# EAGLE design uLED_v1 (EAGLE 9.2.0)
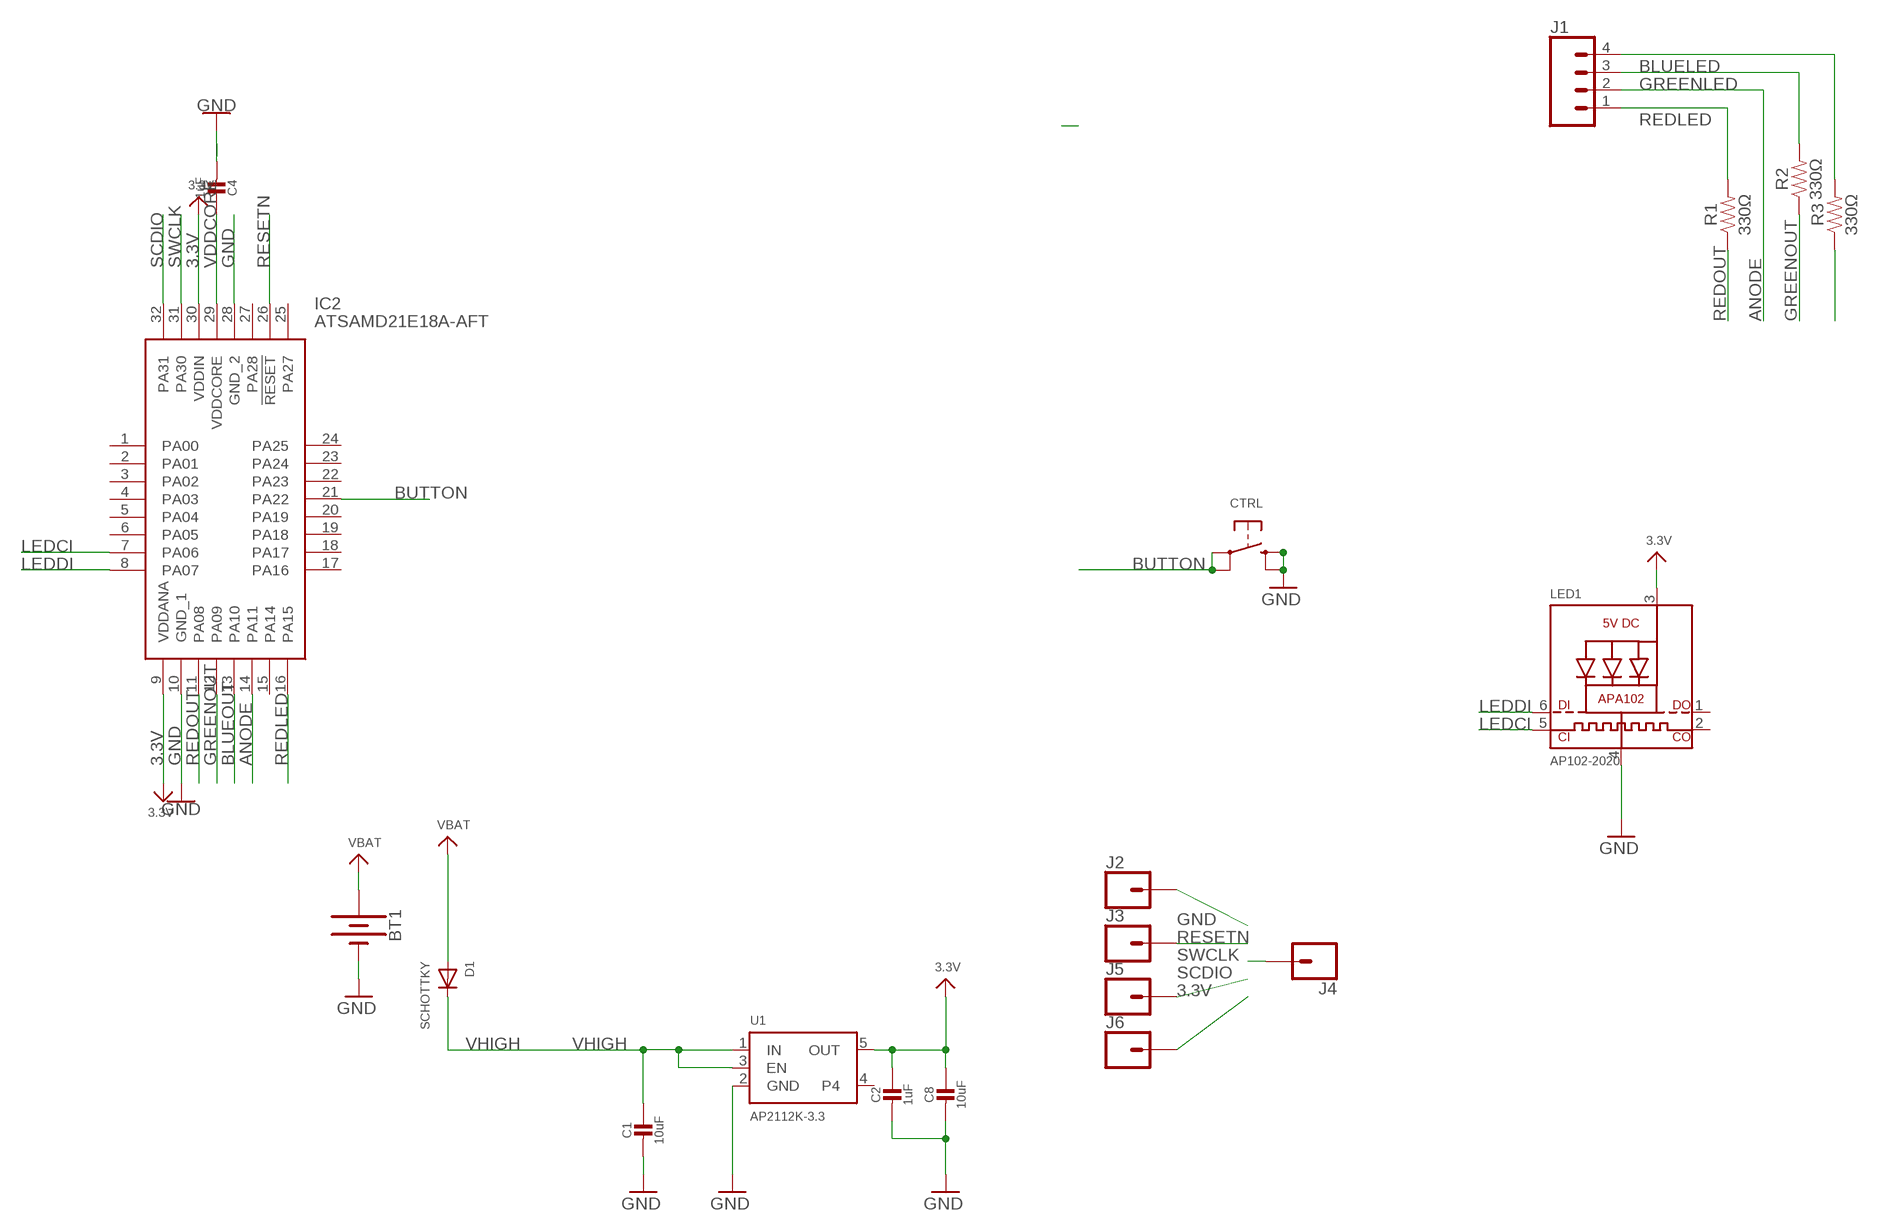
[diagram p0: schematic, sheet 1]

## Parts
BT1  BATTERY-12MM_SMD  [BATTCON_12MM]
C1  10uF  CAP_CERAMIC0805-NOOUTLINE  [0805-NO]
C2  1uF  CAP_CERAMIC0603_NO  [0603-NO]
C4  1uF  CAP_CERAMIC0603_NO  [0603-NO]
C8  10uF  CAP_CERAMIC0805-NOOUTLINE  [0805-NO]
CTRL  SWITCH_TACT_SMT4.6X2.8  [BTN_KMR2_4.6X2.8]
D1  SCHOTTKY  DIODE_SOD-123FL  [SOD-123FL]
IC2  ATSAMD21E18A-AFT  [QFP80P900X900X120-32N]
J1  CONN_04  [1X04]
J2  CONN_01  [1X01]
J3  CONN_01  [1X01]
J4  CONN_01  [1X01]
J5  CONN_01  [1X01]
J6  CONN_01  [1X01]
LED1  AP102-2020  APA1022020  [APA102_2020]
R1  330Ω  0.27OHM-0603-1/10W-1%  [0603]
R2  330Ω  0.27OHM-0603-1/10W-1%  [0603]
R3  330Ω  0.27OHM-0603-1/10W-1%  [0603]
U1  AP2112K-3.3  VREG_SOT23-5  [SOT23-5]

## Nets
3.3V: C2.1 C8.1 IC2.9(VDDANA) IC2.30(VDDIN) J6.1 LED1.3(VDD) U1.5(OUT)
ANODE: IC2.14(PA11) J1.2
BLUELED: J1.4 R3.2
BLUEOUT: IC2.13(PA10) R3.1
BUTTON: CTRL.A'(P1) CTRL.A(P) IC2.21(PA22)
GND: BT1.GND(-) C1.2 C2.2 C4.2 C8.2 CTRL.B'(S1) CTRL.B(S) IC2.10(GND_1) IC2.28(GND_2) J2.1 LED1.4(GND) U1.2(GND)
GREENLED: J1.3 R2.2
GREENOUT: IC2.12(PA09) R2.1
LEDCI: IC2.7(PA06) LED1.5(CKI)
LEDDI: IC2.8(PA07) LED1.6(DI)
REDLED: IC2.16(PA15) J1.1 R1.2
REDOUT: IC2.11(PA08) R1.1
RESETN: IC2.26(!RESET) J3.1
SCDIO: IC2.32(PA31) J5.1
SWCLK: IC2.31(PA30) J4.1
VBAT: BT1.PWR@1(+) D1.A
VDDCORE: C4.1 IC2.29(VDDCORE)
VHIGH: C1.1 D1.C U1.1(IN) U1.3(EN)
Unconnected: IC2.1(PA00) IC2.2(PA01) IC2.3(PA02) IC2.4(PA03) IC2.5(PA04) IC2.6(PA05) IC2.15(PA14) IC2.17(PA16) IC2.18(PA17) IC2.19(PA18) IC2.20(PA19) IC2.22(PA23) IC2.23(PA24) IC2.24(PA25) IC2.25(PA27) IC2.27(PA28) LED1.1(DO) LED1.2(CKO) U1.4

## Library data of the parts
BT1 = SparkFun-Batteries:BATTERY: Battery - Single Cell A variety of battery chemistries, sizes, and footprints. Device List: 20MM_PTH - Coin Cell Battery Holder - 20mm (PTH) <https://www.sparkfun.com/products/783> 20MM_PTH_KIT- Coin Cell battery Holder - 20 mm (PTH) <http://www.sparkfun.com/products/783>kit version with special mask 6.8MM_PTH - Coin Cell Battery Holder - 6.8MM(SMD) <https://www.digikey.com/product-detail/en/seiko-instruments/MS621FE-FL11E/728-1057-ND/1889208?WT.srch=1&gclid=CNOQ5a6LzdQCFZS2wAodXCkE0g> 12MM_SMD - Coin Cell Battery Holder - 12mm (SMD) <https://www.sparkfun.com/products/10592> 12MM_PTH - Coin Cell Battery Holder - 12mm (PTH) <https://www.sparkfun.com/products/7948> 20MM_SMD - 20mm Coin Cell Battery Holder (SMD) (2 legs) Used on the Big Time Watch Kit <https://www.sparkfun.com/products/11734> 20MM_SMD_4LEGS - Coin Cell Battery Holder - 20mm (SMD) <https://www.sparkfun.com/products/11892> 20MM_SMD_4LEGS_OVERPASTE - Coin Cell Battery Holder - 20mm (SMD) <https://www.sparkfun.com/products/11892> (Over-paste on the legs) 24.5MM_PTH - Coin Cell Battery Holder - 24.5mm (PTH) <https://www.sparkfun.com/products/8863> 9V - 9V Battery Holder - PC Mount Used on the SparkFun SparkPunk Sound Kit <https://www.sparkfun.com/products/11177> and SparkFun SparkPunk Sequencer Kit <https://www.sparkfun.com/products/12707> 18650 - Battery Holder - 18650 (PTH) <https://www.sparkfun.com/products/13113> AA - Battery Holder - 1xAA (PTH) <https://www.sparkfun.com/products/7949> AAA - Battery Holder - 1xAAA (PTH) <https://www.sparkfun.com/products/12718> AA_KIT - Battery Holder - 1xAA (PTH) <https://www.sparkfun.com/products/7949> Special kit package - pads only have exposed copper on one side of the board. AAA_KIT - Battery Holder - 1xAAA (PTH) <https://www.sparkfun.com/products/12718> Special kit package - pads only have exposed copper on one side of the board.; PROD_ID: BATT-08044; SF_SKU: PRT-10592
C1 C2 C4 C8 = microbuilder:CAP_CERAMIC: Ceramic Capacitors For new designs, use the packages preceded by an '_' character since they are more reliable: The following footprints should be used on most boards: _0402 - Standard footprint for regular board layouts _0603 - Standard footprint for regular board layouts _0805 - Standard footprint for regular board layouts _1206 - Standard footprint for regular board layouts For extremely tight-pitch boards where space is at a premium, the following 'micro-pitch' footprints can be used (smaller pads, no silkscreen outline, etc.): _0402MP - Micro-pitch footprint for very dense/compact boards _0603MP - Micro-pitch footprint for very dense/compact boards _0805MP - Micro-pitch footprint for very dense/compact boards _1206MP - Micro-pitch footprint for very dense/compact boards
CTRL = microbuilder:SWITCH_TACT_SMT: SMT Tact Switches 6x6mm - Digikey: P12940SCT-ND KMR2 (4.6x2.8mm) - Digikey: 401-1426-1-ND EVQ-PQHB55 - Light Touch, 160GF (4.5x4.5mm) - Digikey: P8090SCT-ND KMT0 - KMT021 NGJ LHS (etc.) IP68/Waterproof - Digikey: CKN10289CT-ND
D1 = adafruit:DIODE: Diode SMADIODE - SMA Surface Mount Package 20V 1A Schottky Diode Digikey: 641-1014-6-ND DO-1N4148 - Through Hole Small Current Diode SOD-123 20V 1 A (.5mV Vf) Schottky Diode - Digikey: MBRX120TPMSCT-ND SOD-323 10V 570mA (.38mV Vf, 3ns) Schottky Diode - Digikey: ZLLS410CT-ND SOD-523 30V 30mA Schottky Diode (RB751S-40TE61) - Digikey: RB751S-40TE61CT-ND SOT23-R/W - SOT23 Package (R = Solder Paste/Reflow Ovens, W = Hand-Soldering) BAT54Film 40V 300mA - Digikey: 497-7162-1-ND
IC2 = SamacSys_Parts:ATSAMD21E18A-AFT: ARM Microcontrollers - MCU Cortex-M0+,64KB FLASH,8KB SRAM T&R, - 32TQFP 125C, GREEN,1.6-3.6V,48MHz Source: Datasheet <https://componentsearchengine.com/Datasheets/1/ATSAMD21E18A-AFT.pdf>; DESCRIPTION: ARM Microcontrollers - MCU Cortex-M0+,64KB FLASH,8KB SRAM T&R, - 32TQFP 125C, GREEN,1.6-3.6V,48MHz; HEIGHT: 1.2mm; MANUFACTURER_NAME: Microchip; MANUFACTURER_PART_NUMBER: ATSAMD21E18A-AFT; MOUSER_PART_NUMBER: 556-ATSAMD21E18A-AFT
J1 = SparkFun-Connectors:CONN_04: Multi connection point. Often used as Generic Header-pin footprint for 0.1 inch spaced/style header connections On any of the 0.1 inch spaced packages, you can populate with these: Break Away Headers - Straight <https://www.sparkfun.com/products/116> (PRT-00116) Break Away Male Headers - Right Angle <https://www.sparkfun.com/products/553> (PRT-00553) Female Headers <https://www.sparkfun.com/products/115> (PRT-00115) Break Away Headers - Machine Pin <https://www.sparkfun.com/products/117> (PRT-00117) Break Away Female Headers - Swiss Machine Pin <https://www.sparkfun.com/products/743> (PRT-00743) For SCREWTERMINALS and SPRING TERMINALS visit here: Screw Terimnals on SparkFun.com <https://www.sparkfun.com/search/results?term=Screw+Terminals> (5mm/3.5mm/2.54mm spacing) This device is also useful as a general connection point to wire up your design to another part of your project. Our various solder wires solder well into these plated through hole pads. Hook-Up Wire - Assortment (Stranded, 22 AWG) <https://www.sparkfun.com/products/11375> (PRT-11375) Hook-Up Wire - Assortment (Solid Core, 22 AWG) <https://www.sparkfun.com/products/11367> (PRT-11367) View the entire wire category on our website here <https://www.sparkfun.com/categories/141> Special notes: Molex polarized connector foot print use with SKU : PRT-08231 with associated crimp pins and housings. 1MM SMD Version SKU: PRT-10208; PROD_ID: CONN-09696
J2-J6 = SparkFun-Connectors:CONN_01: Single connection point. Often used as Generic Header-pin footprint for 0.1 inch spaced/style header connections On any of the 0.1 inch spaced packages, you can populate with these: Break Away Headers - Straight <https://www.sparkfun.com/products/116> (PRT-00116) Break Away Male Headers - Right Angle <https://www.sparkfun.com/products/553> (PRT-00553) Female Headers <https://www.sparkfun.com/products/115> (PRT-00115) Break Away Headers - Machine Pin <https://www.sparkfun.com/products/117> (PRT-00117) Break Away Female Headers - Swiss Machine Pin <https://www.sparkfun.com/products/743> (PRT-00743) This device is also useful as a general connection point to wire up your design to another part of your project. Our various solder wires solder well into these plated through hole pads. Hook-Up Wire - Assortment (Stranded, 22 AWG) <https://www.sparkfun.com/products/11375> (PRT-11375) Hook-Up Wire - Assortment (Solid Core, 22 AWG) <https://www.sparkfun.com/products/11367> (PRT-11367) View the entire wire category on our website here <https://www.sparkfun.com/categories/141> Special notes: SMTSO-256-ET is a "flush mount" nut for a 4-40 screw. We mostly use this on specialty testbeds; it is a nice way to connect hardware to your PCB at an adjustable hieght. Also note, the SNAP packages are for using a snappable style connector. We sell a baggie of snaps and they are also used on two LilyPad designs: Snap Assortment - 30 pack (male and female) <https://www.sparkfun.com/products/11347> (DEV-11347) LilyPad Arduino SimpleSnap <https://www.sparkfun.com/products/10941> (DEV-10941) LilyPad SimpleSnap Protoboard <https://www.sparkfun.com/products/10940> (DEV-10940)
LED1 = microbuilder:APA102: APA102/DotStar Pixels VCC: 5V DC Refresh Rate: 400Hz
R1-R3 = SparkFun-Resistors:0.27OHM: 0.27Ω resistor A resistor is a passive two-terminal electrical component that implements electrical resistance as a circuit element. Resistors act to reduce current flow, and, at the same time, act to lower voltage levels within circuits. - Wikipedia; PROD_ID: RES-08787; VALUE: 0.27
U1 = microbuilder:VREG_SOT23-5: SOT23-5 Fixed Voltage Regulators Part Current Out V Out V In V Dropout θJA (°C/W) TJ (°C) Digikey Part No. ADP121 150mA 3.3V 3.4-5.5V 0.09V @ 150mA -- -- ADP121-AUJZ33R7CT-ND ADP121 150mA 3.0V 3.1-5.5V 0.09V @ 150mA -- -- ADP121-AUJZ30R7CT-ND ADP122 300mA 3.3V 3.4-5.5V 0.085V @ 300mA -- -- ADP122AUJZ-3.3-R7CT-ND ADP1712 300mA 3.3V 3.5-5.5V 0.17V @ 300mA -- -- ADP1712AUJZ-3.3-R7TR-ND AP7311 (Low Cost) 150mA 3.3V 3.5-6V 0.15V @ 150mA -- -- AP7311-33WG-7DICT-ND LD39015M18R 150mA 1.8V 1.9V-5.5V 0.08V @ 100mA -- -- 497-6977-1-ND LP2985A-33DBVR 150mA 3.3V 3.3-16V 0.28V @ 150mA 206 150 296-18479-1-ND MCP1824T-3302E/OT 300mA 3.3V 3.5V-6V 0.2V @ 300mA -- -- MCP1824T-3302E/OTCT-ND MIC5205-2.5YM5 TR 150mA 2.5V 2.7-16V 0.165V @ 150mA -- -- 576-1257-2-ND MIC5205-3.0YM5 TR 150mA 3.0V 3.2V-16V 0.165V @ 150mA -- -- 576-1258-2-ND MIC5205-3.3YM5 TR 150mA 3.3V 3.5V-16V 0.165V @ 150mA -- -- 576-1259-2-ND TPS780330220 150mA 3.3V+2.2V 3.6-5.5V 250mV Max -- -- 296-23332-1-ND TDA3663/N1,135 100mA 3.3V 3.5-45V 0.18V @ 50mA -- -- 568-5343-1-ND Max operating temp can be calculated using θJA, TJ (max junction temperature), and power in watts. Set the "Maximum Ambient Temperature" until it reaches TJ ("Max Junction Temperature"), which is the absolute limit for safe use of the regulator: Heat Sink Temperature Calculator <http://www.daycounter.com/Calculators/Heat-Sink-Temperature-Calculator.phtml> For example, With 12V source into a 3.3V LP2985 and a 30mA load, we are dissipating (12V-3.3V) * 0.03A = 0.261W. With a θJA of 206 °C/W, a TJ of 150°C, and 261mW we can safely use the chip without a heat sink up to 75°C (=147.1°C Junction Temperature).

## Board
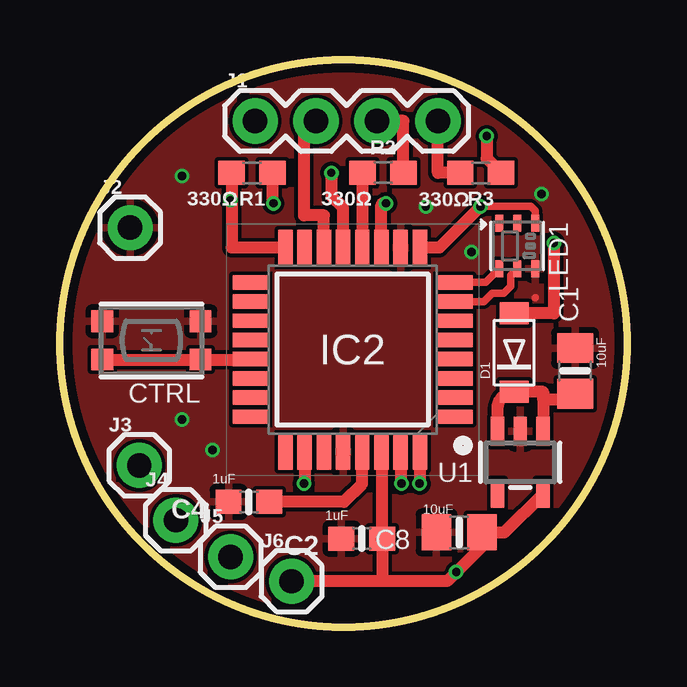
[diagram p1: board, top side]
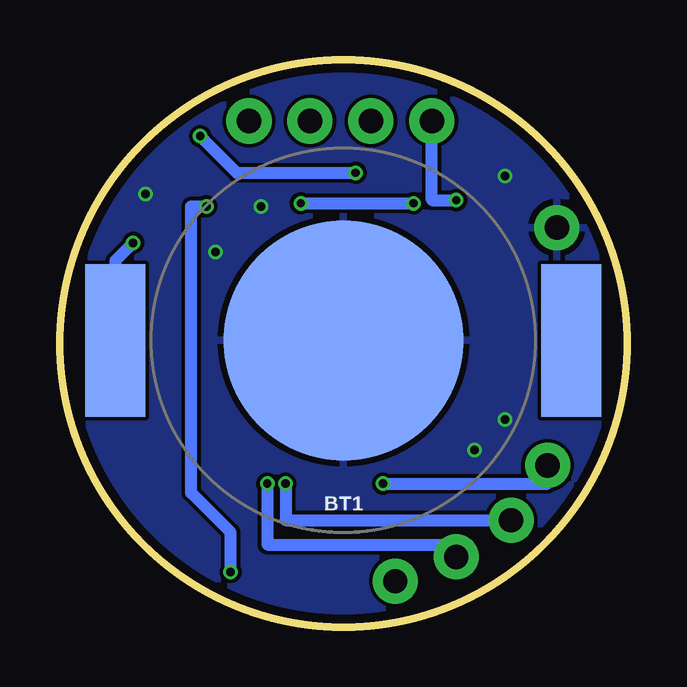
[diagram p2: board, bottom side, seen from below]

Size 23.62 x 23.62 mm. Coordinates in mm from the lower left corner, seen from the top.
Outline: circle at 11.81,11.81 radius 11.81
Copper layers (1*16): Top 0.035559375mm / dielectric 1.6mm / Bottom 0.035559375mm
Design rules "oshpark-2layer": minimum track width 6mil, minimum drill 10mil, track to track 6mil, track to pad 6mil, pad to pad 6mil, via to via 6mil, smd to smd 6mil, copper to edge 15mil, drill to drill 6mil, minimum pad ring 5mil, minimum via ring 5mil, stop-mask expansion 2.5mil, vias tented up to drill 0mil, thermal gap 10mil

### Footprints (pad centres in the part's own frame; a part is rotated, then mirrored left to right if it is on the bottom)
BATTCON_12MM = smd 10 x 10: GND 0,0 | smd 2.5 x 6.35: PWR@1 -9.5,0; PWR@2 9.5,0
0805-NO = smd 1.24 x 1.5: 1 -0.95,0; 2 0.95,0
0603-NO = smd 1.075 x 1: 1 -0.85,0; 2 0.85,0
BTN_KMR2_4.6X2.8 = smd 0.9 x 0.9: A 2.05,0.8; A' -2.05,0.8; B 2.05,-0.8; B' -2.05,-0.8
SOD-123FL = smd 0.91 x 1.22: A 1.637,0; C -1.637,0
QFP80P900X900X120-32N = smd 1.5 x 0.6: 1 -4.25,2.8; 2 -4.25,2; 3 -4.25,1.2; 4 -4.25,0.4; 5 -4.25,-0.4; 6 -4.25,-1.2; 7 -4.25,-2; 8 -4.25,-2.8; 17 4.25,-2.8; 18 4.25,-2; 19 4.25,-1.2; 20 4.25,-0.4; 21 4.25,0.4; 22 4.25,1.2; 23 4.25,2; 24 4.25,2.8 | smd 0.6 x 1.5: 9 -2.8,-4.25; 10 -2,-4.25; 11 -1.2,-4.25; 12 -0.4,-4.25; 13 0.4,-4.25; 14 1.2,-4.25; 15 2,-4.25; 16 2.8,-4.25; 25 2.8,4.25; 26 2,4.25; 27 1.2,4.25; 28 0.4,4.25; 29 -0.4,4.25; 30 -1.2,4.25; 31 -2,4.25; 32 -2.8,4.25
1X04 = drill 1.016 pad 1.88: 1 0,0; 2 2.54,0; 3 5.08,0; 4 7.62,0
1X01 = drill 1.016 pad 1.88: 1 0,0
APA102_2020 = smd 0.7 x 0.35: 1 -0.95,-0.75; 2 -0.95,0; 3 -0.95,0.75; 4 0.95,0.75; 5 0.95,0; 6 0.95,-0.75
0603 = smd 1.1 x 1: 1 -0.85,0; 2 0.85,0
SOT23-5 = smd 0.55 x 1.2: 1 -0.95,-1.3; 2 0,-1.3; 3 0.95,-1.3; 4 0.95,1.3; 5 -0.95,1.3

### Placement (x,y rotation side)
BT1  11.81,11.94 0 bottom
C1  21.46,10.67 90 top
C2  12.57,3.68 180 top
C4  7.87,5.21 180 top
C8  16.64,3.94 180 top
CTRL  3.81,11.94 180 top
D1  18.92,11.43 90 top
IC2  12.19,11.56 180 top
J1  8.13,21.08 0 top
J2  2.92,16.64 0 top
J3  3.3,6.73 0 top
J4  4.83,4.45 0 top
J5  7.11,2.92 0 top
J6  9.65,1.9 0 top
LED1  19.05,15.88 270 top
R1  8,18.92 180 top
R2  13.46,18.92 0 top
R3  17.53,18.92 180 top
U1  19.18,6.86 180 top

### Tracks (layer width: path | path; a pad name or v marks a point on that pad's centre or on a via)
3.3V  (via drill 0.35)
  Top 0.305: LED1.3 19.8,17.33 19.61,17.53 v17.53,17.53
  Top 0.508: v17.53,17.53 15.81,15.81 IC2.9 | 13.46,1.9 16.13,1.9 v16.51,2.29 17.59,3.36 C8.1 18.51,3.94 U1.5 | 13.46,1.9 J6.1 | 13.46,1.9 13.42,1.94 C2.1 13.42,7.28 IC2.30
  Bottom 0.508: v16.51,2.29 16.51,3.94 18.16,5.59 18.16,17.53 v17.53,17.53
ANODE
  Top 0.508: IC2.14 10.99,17.14 10.16,17.14 10.16,21.08 J1.2
BLUELED
  Top 0.508: R3.2 15.75,18.92 J1.4
BLUEOUT  (via drill 0.35)
  Top 0.508: v11.3,18.92 11.3,17.95 11.79,17.46 IC2.13 | v17.78,20.45 17.78,19.52 R3.1
  Bottom 0.508: v17.78,20.45 16.26,18.92 v11.3,18.92
BUTTON
  Top 0.508: CTRL.A CTRL.A' 7.92,11.14 IC2.21
GND  (via drill 0.35)
  Top 0.305: 19.8,13.72 19.81,13.72
  other vias: 20.07,18.03 17.15,15.62 15.24,17.53 5.08,18.8 5.08,8.64 6.35,7.37
  pour Top: -3.43,27.18 -3.43,-0.76 28.32,-0.76 28.32,27.18
  pour Bottom: 24.51,25.91 24.51,-0.76 -0.89,-0.76 -0.89,25.91
GREENLED
  Top 0.508: R2.2 14.31,21.08 J1.3
GREENOUT
  Top 0.508: IC2.12 12.61,15.81 R2.1
LEDCI
  Top 0.305: IC2.7 17.66,13.56 18.01,13.9 18.49,13.9 18.78,14.19 18.78,14.66 LED1.5
LEDDI
  Top 0.305: IC2.8 17.73,14.36 LED1.6
REDLED  (via drill 0.35)
  Top 0.508: R1.2 7.15,17.78 v7.11,17.78 7.15,17.74 7.15,15.81 IC2.16
  Bottom 0.508: v7.11,17.78 8.13,17.78 J1.1
REDOUT  (via drill 0.35)
  Top 0.508: R1.1 8.85,17.65 v8.89,17.65 | v13.59,17.65 v13.59,17.66 13.46,17.66 13.39,17.59 IC2.11
  Bottom 0.508: v13.59,17.65 v8.89,17.65
RESETN  (via drill 0.35)
  Top 0.508: IC2.26 10.19,5.97 v10.16,5.97
  Bottom 0.508: v10.16,5.97 3.3,5.97 J3.1
SCDIO  (via drill 0.35)
  Top 0.508: IC2.32 v14.99,5.97
  Bottom 0.508: v14.99,5.97 14.99,3.43 7.62,3.43 J5.1
SWCLK  (via drill 0.35)
  Top 0.508: IC2.31 14.19,5.97 v14.22,5.97
  Bottom 0.508: v14.22,5.97 14.22,4.45 J4.1
VBAT  (via drill 0.35)
  Top 0.508: v20.57,16 20.57,13.07 D1.A
  Bottom 0.508: v20.57,16 21.31,15.27 BT1.PWR@1
VDDCORE
  Top 0.508: IC2.29 12.59,5.97 11.83,5.21 C4.1
VHIGH
  Top 0.305: 21.46,9.49 C1.1
  Top 0.508: U1.3 18.23,9.1 arc-90 D1.C 20.13,9.79 20.13,9.49 | 20.13,9.49 U1.1 | 20.13,9.49 21.46,9.49